# Altium schematic sheet Ampli2.SchDoc
size A4
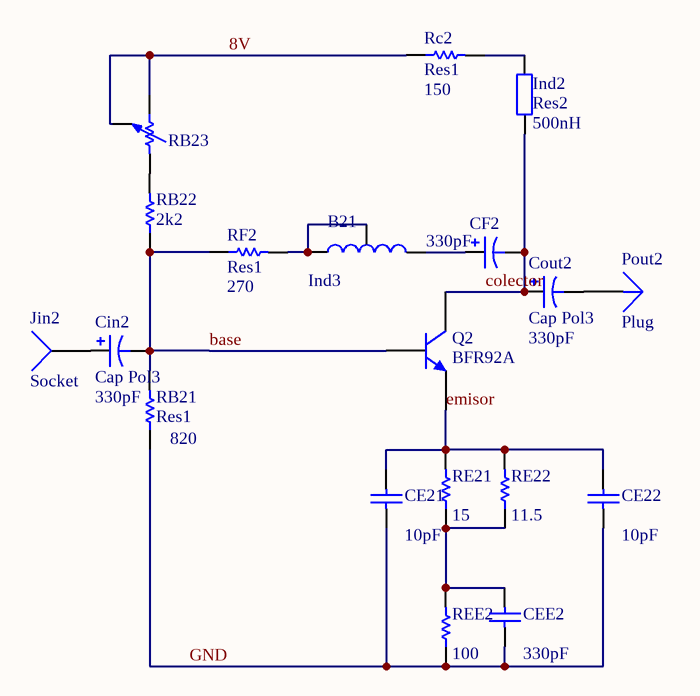
[diagram p0: Ampli2.SchDoc]

## Parts
B21  Ind3  [Ind 7mm]
CE21  value 10pF  [1608[0603]]  (hidden comment: Cap Semi)
CE22  value 10pF  [1608[0603]]  (hidden comment: Cap Semi)
CEE2  value 330pF  [1608[0603]]  (hidden comment: Cap Semi)
CF2  value 330pF  [C0805]  (hidden comment: Cap Pol3)
Cin2  Cap Pol3  value 330pF  [C0805]
Cout2  Cap Pol3  value 330pF  [C0805]
Ind2  Res2  value 500nH  [AXIAL-0.4]
Jin2  Socket  [PIN1]
Pout2  Plug  [PIN1]
Q2  BFR92A  [SOT23]
RB21  Res1  value 820  [AXIAL-0.3]
RB22  value 2k2  [AXIAL-0.3]  (hidden comment: Res1)
RB23  Pot  [Potenciometro]  (value not drawn)
Rc2  Res1  value 150  [AXIAL-0.3]
RE21  value 15  [1608[0603]]  (hidden comment: Res Semi)
RE22  value 11.5  [2012[0805]]  (hidden comment: Res Semi)
REE2  value 100  [2012[0805]]  (hidden comment: Res Semi)
RF2  Res1  value 270  [AXIAL-0.3]

## Nets
8V: RB23.2 RB23.3 Rc2.1
base: Cin2.2 Q2.1(B) RB21.2 RB22.1 RF2.1
colector: CF2.2 Cout2.1 Ind2.1 Q2.3(C)
emisor: CE21.2 CE22.2 Q2.2(E) RE21.2 RE22.2
GND: CE21.1 CE22.1 CEE2.1 RB21.1 REE2.1
NetB21_0: B21.0 B21.2 RF2.2
NetB21_1: B21.1 CF2.1
NetCEE2_2: CEE2.2 RE21.1 RE22.1 REE2.2
NetCin2_1: Cin2.1 Jin2.1
NetCout2_2: Cout2.2 Pout2.1
NetInd2_2: Ind2.2 Rc2.2
NetRB22_2: RB22.2 RB23.1

## Library data of the parts
CE21 CE22 CEE2 = Cap Semi: Capacitor (Semiconductor SIM Model); Published: 8-Jun-2000; LatestRevisionDate: 17-Jul-2002; LatestRevisionNote: Re-released for DXP Platform.; PackageReference: C1206; Publisher: Altium Limited
CF2 Cin2 Cout2 = Cap Pol3: Polarized Capacitor (Surface Mount); Published: 8-Jun-2000; LatestRevisionDate: 17-Jul-2002; LatestRevisionNote: Re-released for DXP Platform.; PackageReference: C0805; Publisher: Altium Limited
Ind2 = Res2: Resistor; Published: 8-Jun-2000; LatestRevisionDate: 17-Jul-2002; LatestRevisionNote: Re-released for DXP Platform.; PackageReference: AXIAL-0.4; Publisher: Altium Limited
Q2 = BFR92A: NPN 5 GHz Wideband Transistor; Published: 17-Sep-2003; DatasheetDocument: 29-Oct-1997; PackageDocument: May-1999; PackageReference: SOT23; Publisher: Altium Limited; ComponentLink1Description: Manufacturer Link; ComponentLink1URL: http://www.semiconductors.philips.com/; ComponentLink2Description: Datasheet; ComponentLink2URL: http://www.semiconductors.philips.com/acrobat/datasheets/BFR92A_2.pdf
RB21 RB22 Rc2 RF2 = Res1: Resistor; Published: 8-Jun-2000; LatestRevisionDate: 17-Jul-2002; LatestRevisionNote: Re-released for DXP Platform.; PackageReference: AXIAL-0.3; Publisher: Altium Limited
RE21 RE22 REE2 = Res Semi: Semiconductor Resistor; Published: 8-Jun-2000; LatestRevisionDate: 17-Jul-2002; LatestRevisionNote: Re-released for DXP Platform.; PackageReference: AXIAL-0.5; Publisher: Altium Limited
Jin2 = Socket: LatestRevisionDate: 17-Jul-2002; LatestRevisionNote: Re-released for DXP Platform.; Publisher: Altium Limited
Pout2 = Plug: LatestRevisionDate: 17-Jul-2002; LatestRevisionNote: Re-released for DXP Platform.; Publisher: Altium Limited